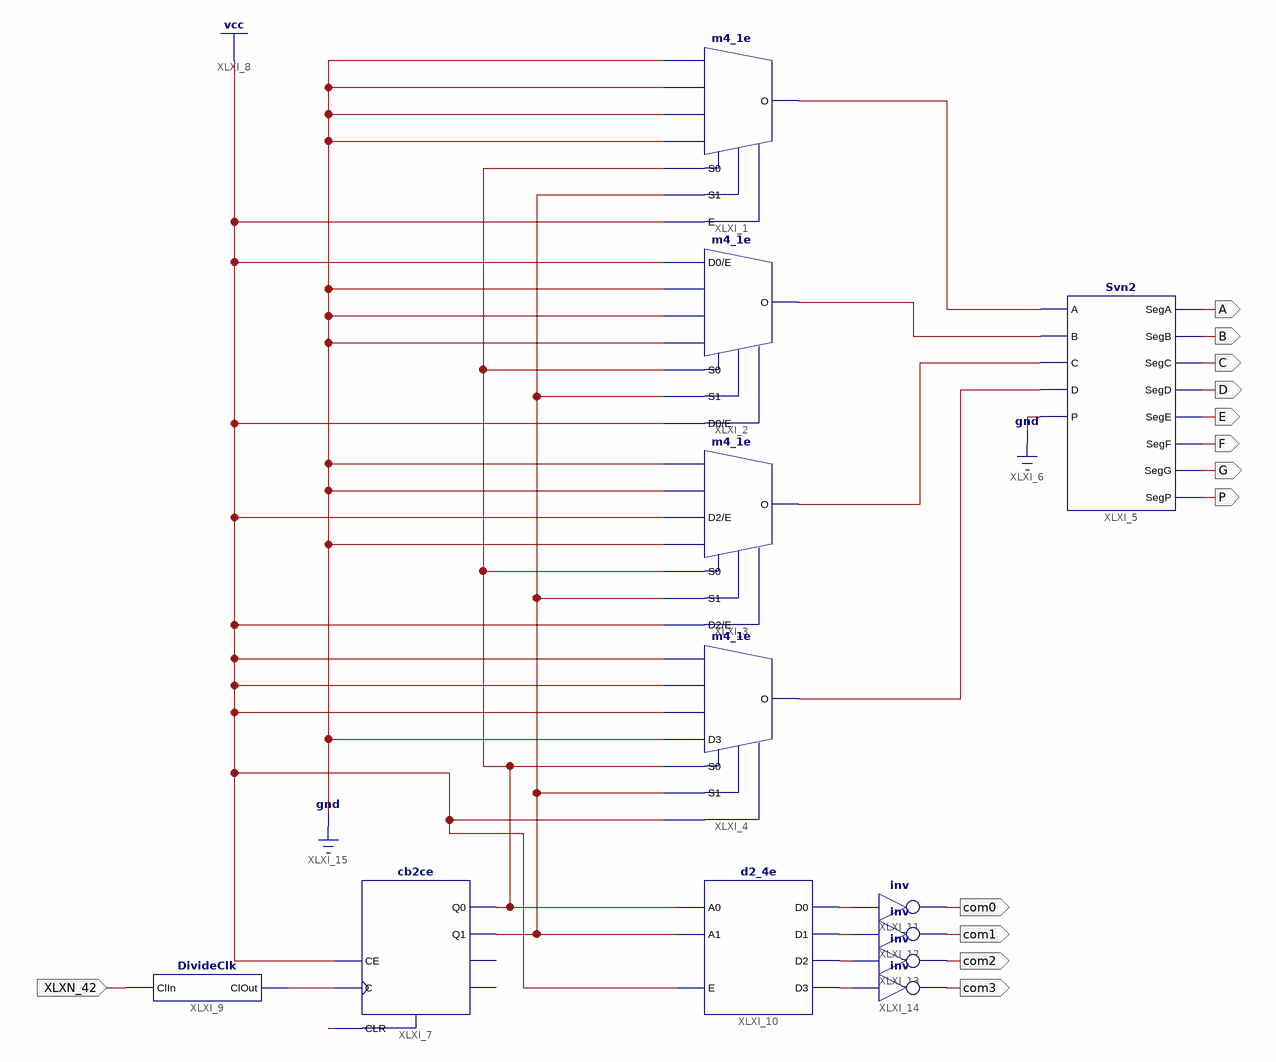
[diagram p0: schematic sheet 1]
// Xilinx ISE schematic res.sch (spartan6) as structural Verilog: 12 symbols, 13 ports
module res (
  input  XLXN_42,
  output A,
  output B,
  output C,
  output D,
  output E,
  output F,
  output G,
  output P,
  output com0,
  output com1,
  output com2,
  output com3
);

  wire XLXN_1, XLXN_2, XLXN_3, XLXN_5, XLXN_23, XLXN_24, XLXN_33, XLXN_34, XLXN_35, XLXN_36, XLXN_37, XLXN_45;

  m4_1e XLXI_1 (.D0(1'b0), .D1(1'b0), .D2(1'b0), .D3(1'b0), .E(1'b1), .S0(XLXN_23), .S1(XLXN_24), .O(XLXN_1));
  m4_1e XLXI_2 (.D0(1'b1), .D1(1'b0), .D2(1'b0), .D3(1'b0), .E(1'b1), .S0(XLXN_23), .S1(XLXN_24), .O(XLXN_2));
  m4_1e XLXI_3 (.D0(1'b0), .D1(1'b0), .D2(1'b1), .D3(1'b0), .E(1'b1), .S0(XLXN_23), .S1(XLXN_24), .O(XLXN_3));
  m4_1e XLXI_4 (.D0(1'b1), .D1(1'b1), .D2(1'b1), .D3(1'b0), .E(1'b1), .S0(XLXN_23), .S1(XLXN_24), .O(XLXN_5));
  Svn2 XLXI_5 (
    .A(XLXN_1), .B(XLXN_2), .C(XLXN_3), .D(XLXN_5), .P(1'b0), .SegA(A), .SegB(B), .SegC(C), .SegD(D),
    .SegE(E), .SegF(F), .SegG(G), .SegP(P));
  cb2ce XLXI_7 (.C(XLXN_33), .CE(1'b1), .CLR(XLXN_45), .Q0(XLXN_23), .Q1(XLXN_24));  // open: CEO, TC
  DivideClk XLXI_9 (.ClIn(XLXN_42), .ClOut(XLXN_33));
  d2_4e XLXI_10 (.A0(XLXN_23), .A1(XLXN_24), .E(1'b1), .D0(XLXN_34), .D1(XLXN_35), .D2(XLXN_36), .D3(XLXN_37));
  not XLXI_11 (com0, XLXN_34);
  not XLXI_12 (com1, XLXN_35);
  not XLXI_13 (com2, XLXN_36);
  not XLXI_14 (com3, XLXN_37);
endmodule
